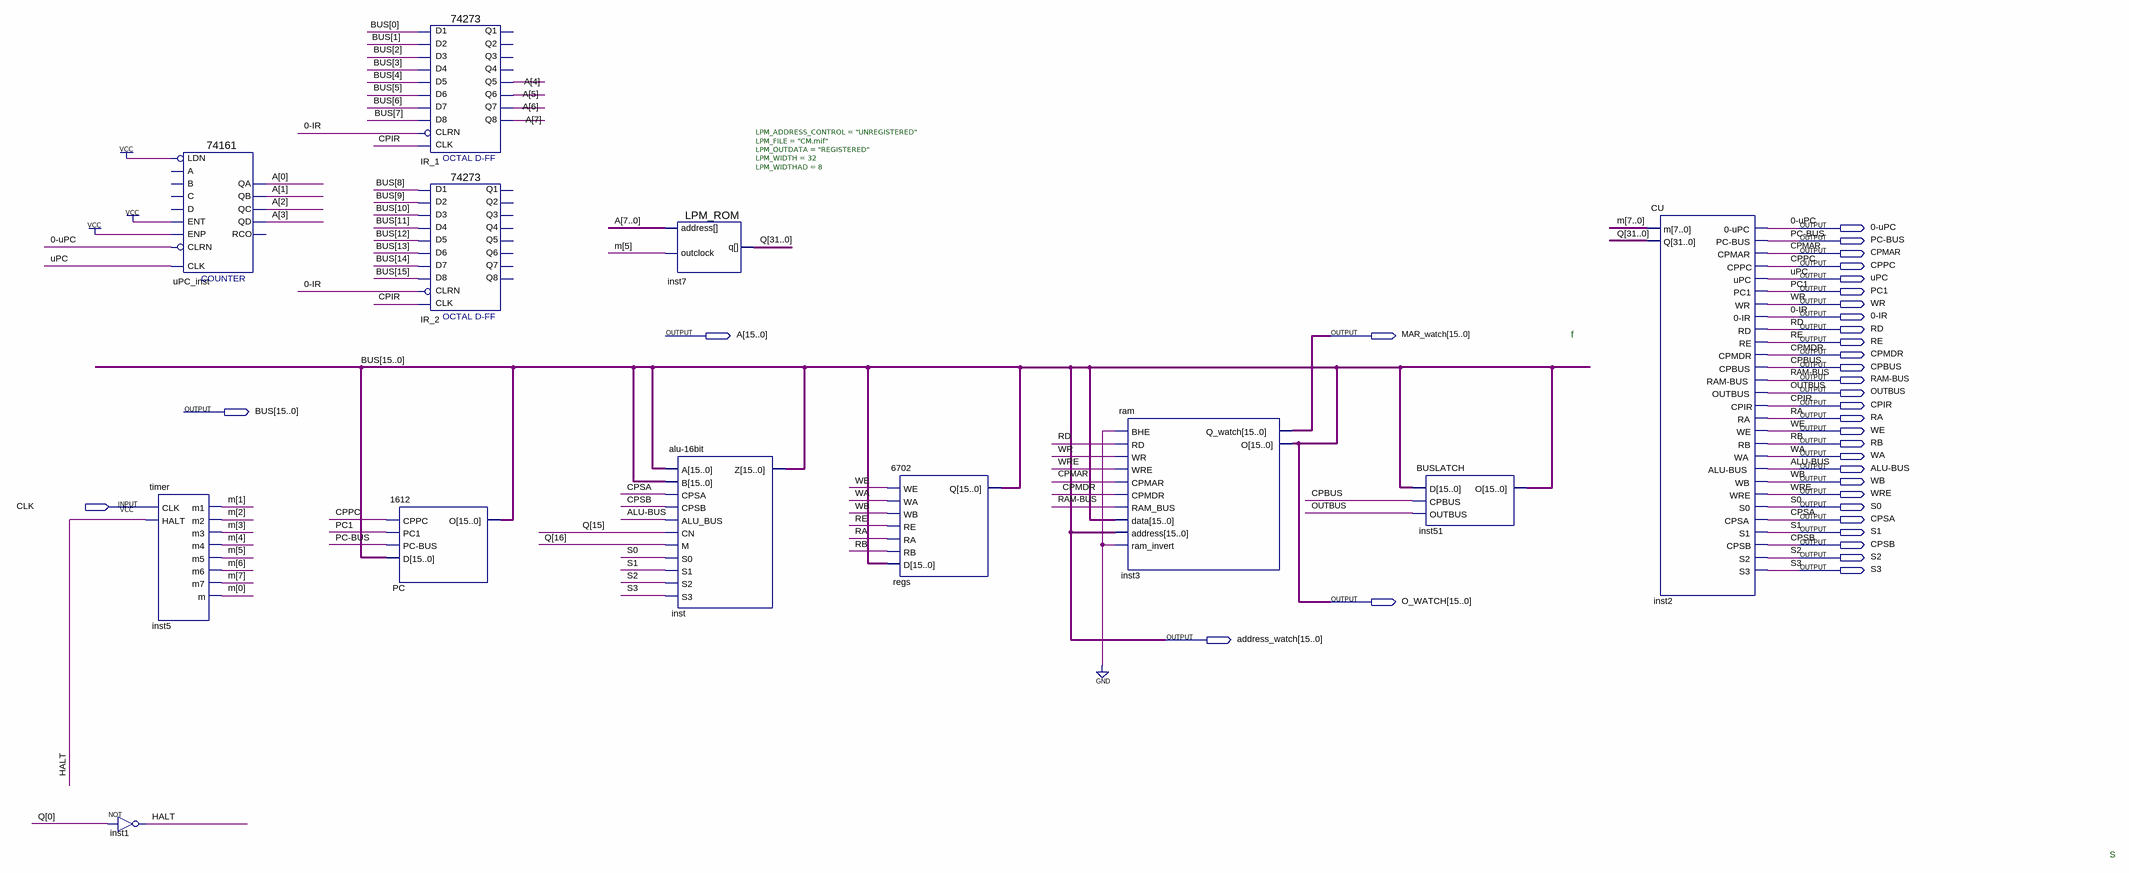
[diagram p0: schematic sheet]
// Quartus schematic CPU_8086.bdf as structural Verilog: 12 symbols, 34 pins
module CPU_8086 (
  input  CLK,
  output \0-uPC ,
  output \PC-BUS ,
  output CPMAR,
  output CPPC,
  output uPC,
  output PC1,
  output WR,
  output \0-IR ,
  output RD,
  output [15:0] A,
  output [15:0] MAR_watch,
  output RE,
  output CPMDR,
  output CPBUS,
  output \RAM-BUS ,
  output OUTBUS,
  output CPIR,
  output [15:0] BUS,
  output RA,
  output WE,
  output RB,
  output WA,
  output \ALU-BUS ,
  output WB,
  output WRE,
  output S0,
  output CPSA,
  output S1,
  output CPSB,
  output S2,
  output S3,
  output [15:0] O_WATCH,
  output [15:0] address_watch
);

  wire HALT;
  wire [7:0] m;
  wire [31:0] Q;

  not inst1 (HALT, Q[0]);
  \74161  uPC_inst (
    .CLRN(\0-uPC ), .CLK(uPC), .ENP(1'b1), .LDN(1'b1), .ENT(1'b1), .QD(A[3]), .QC(A[2]), .QB(A[1]), .QA(A[0]));  // open: A, D, B, C, RCO
  timer inst5 (
    .CLK(CLK), .HALT(HALT), .m1(m[1]), .m2(m[2]), .m3(m[3]), .m4(m[4]), .m5(m[5]), .m6(m[6]), .m7(m[7]),
    .m(m[0]));
  \1612  PC (.CPPC(CPPC), .PC1(PC1), .\PC-BUS (\PC-BUS ), .D(address_watch), .O(address_watch));
  \74273  IR_1 (
    .D2(address_watch[1]), .D3(address_watch[2]), .D1(address_watch[0]), .D4(address_watch[3]),
    .D7(address_watch[6]), .D6(address_watch[5]), .D5(address_watch[4]), .D8(address_watch[7]), .CLK(CPIR),
    .CLRN(\0-IR ), .Q6(A[5]), .Q5(A[4]), .Q7(A[6]), .Q8(A[7]));  // open: Q4, Q1, Q2, Q3
  \74273  IR_2 (
    .D2(address_watch[9]), .D3(address_watch[10]), .D1(address_watch[8]), .D4(address_watch[11]),
    .D7(address_watch[14]), .D6(address_watch[13]), .D5(address_watch[12]), .D8(address_watch[15]),
    .CLK(CPIR), .CLRN(\0-IR ));  // open: Q4, Q1, Q2, Q3, Q6, Q5, Q7, Q8
  LPM_ROM #(.LPM_ADDRESS_CONTROL("UNREGISTERED"), .LPM_FILE("CM.mif"), .LPM_OUTDATA("REGISTERED"), .LPM_WIDTH(32), .LPM_WIDTHAD(8)) inst7 (
    .address(A[7:0]), .outclock(m[5]), .q(Q));
  \alu-16bit  inst (
    .A(address_watch), .B(address_watch), .CPSA(CPSA), .CPSB(CPSB), .ALU_BUS(\ALU-BUS ), .CN(Q[15]),
    .M(Q[16]), .S0(S0), .S1(S1), .S2(S2), .S3(S3), .Z(address_watch));
  \6702  regs (.WE(WE), .WA(WA), .WB(WB), .RE(RE), .RA(RA), .RB(RB), .D(address_watch), .Q(address_watch));
  ram inst3 (
    .BHE(1'b0), .RD(RD), .WR(WR), .WRE(WRE), .CPMAR(CPMAR), .CPMDR(CPMDR), .RAM_BUS(\RAM-BUS ),
    .data(address_watch), .address(address_watch), .ram_invert(1'b0), .Q_watch(MAR_watch), .O(address_watch));
  BUSLATCH inst51 (.D(address_watch), .CPBUS(CPBUS), .OUTBUS(OUTBUS), .O(address_watch));
  CU inst2 (
    .m(m), .Q(Q), .\0-uPC (\0-uPC ), .\PC-BUS (\PC-BUS ), .CPMAR(CPMAR), .CPPC(CPPC), .uPC(uPC), .PC1(PC1),
    .WR(WR), .\0-IR (\0-IR ), .RD(RD), .RE(RE), .CPMDR(CPMDR), .CPBUS(CPBUS), .\RAM-BUS (\RAM-BUS ),
    .OUTBUS(OUTBUS), .CPIR(CPIR), .RA(RA), .WE(WE), .RB(RB), .WA(WA), .\ALU-BUS (\ALU-BUS ), .WB(WB),
    .WRE(WRE), .S0(S0), .CPSA(CPSA), .S1(S1), .CPSB(CPSB), .S2(S2), .S3(S3));

  assign BUS = address_watch;
  assign O_WATCH = address_watch;

  // Notes on the sheet:
  //   f
  //   S
endmodule
